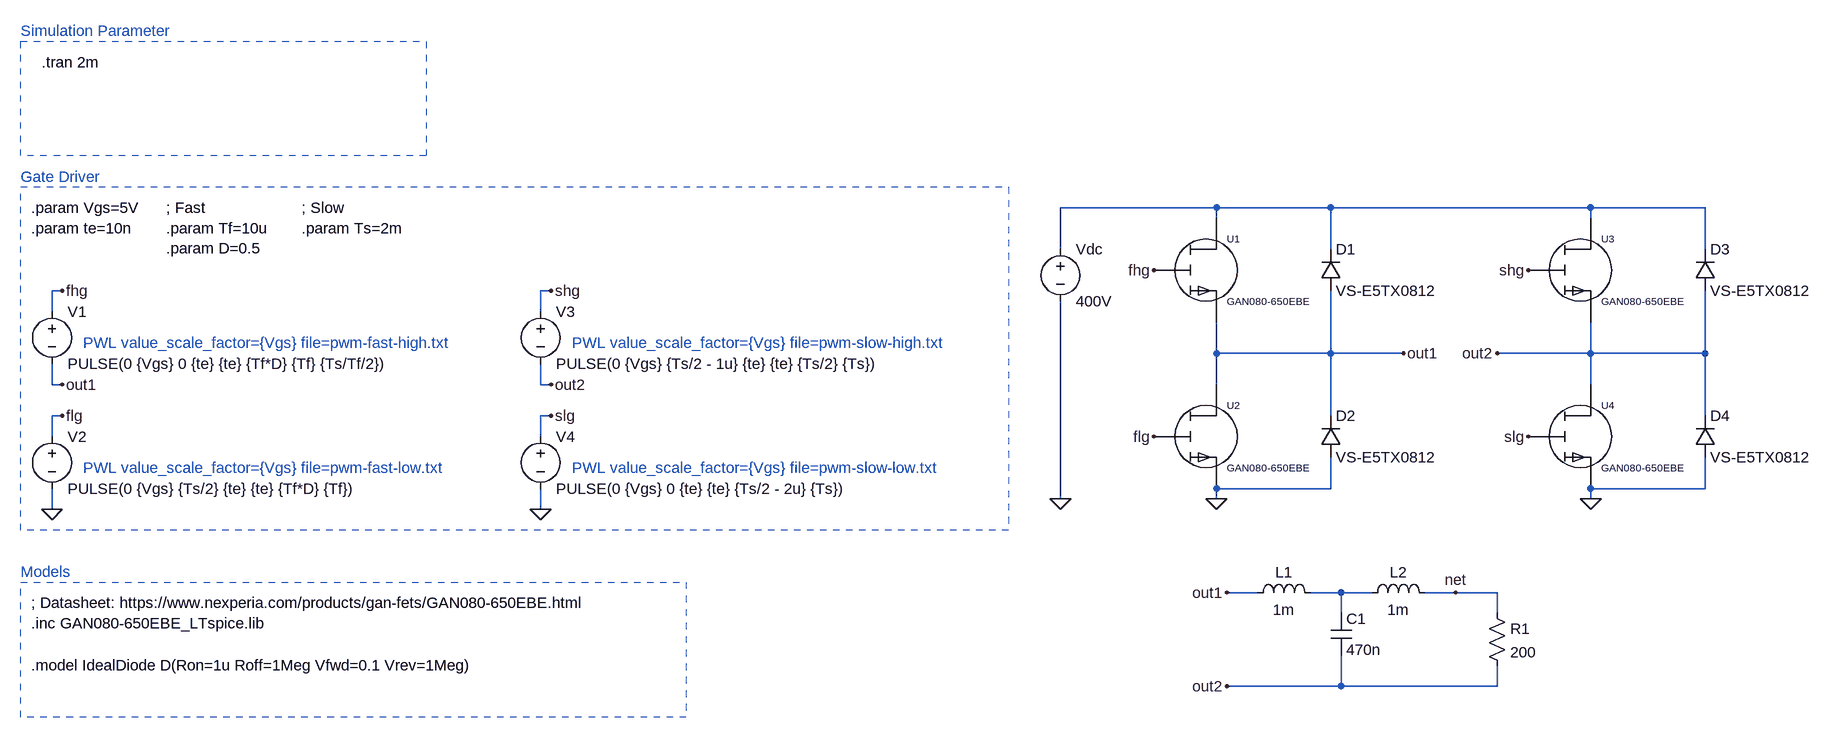
[diagram p0: schematic dc-ac-inverter.asc]
dc-ac-inverter.asc, the LTspice schematic file:
Version 4
SHEET 1 4648 30344
WIRE 560 -416 320 -416
WIRE 736 -416 560 -416
WIRE 1136 -416 736 -416
WIRE 1312 -416 1136 -416
WIRE 560 -400 560 -416
WIRE 1136 -400 1136 -416
WIRE 320 -352 320 -416
WIRE 736 -352 736 -416
WIRE 1312 -352 1312 -416
WIRE -1216 -288 -1232 -288
WIRE -464 -288 -480 -288
WIRE -1232 -256 -1232 -288
WIRE -480 -256 -480 -288
WIRE 560 -192 560 -240
WIRE 736 -192 736 -288
WIRE 736 -192 560 -192
WIRE 848 -192 736 -192
WIRE 1136 -192 1136 -240
WIRE 1136 -192 992 -192
WIRE 1312 -192 1312 -288
WIRE 1312 -192 1136 -192
WIRE -1232 -144 -1232 -176
WIRE -1216 -144 -1232 -144
WIRE -480 -144 -480 -176
WIRE -464 -144 -480 -144
WIRE 560 -144 560 -192
WIRE 1136 -144 1136 -192
WIRE -1216 -96 -1232 -96
WIRE -464 -96 -480 -96
WIRE 736 -96 736 -192
WIRE 1312 -96 1312 -192
WIRE -1232 -64 -1232 -96
WIRE -480 -64 -480 -96
WIRE 736 16 736 -32
WIRE 736 16 560 16
WIRE 1312 16 1312 -32
WIRE 1312 16 1136 16
WIRE 320 32 320 -272
WIRE 560 32 560 16
WIRE 1136 32 1136 16
WIRE -1232 48 -1232 16
WIRE -480 48 -480 16
WIRE 624 176 576 176
WIRE 752 176 704 176
WIRE 800 176 752 176
WIRE 928 176 880 176
WIRE 992 176 928 176
WIRE 752 208 752 176
WIRE 992 208 992 176
WIRE 752 320 752 272
WIRE 752 320 576 320
WIRE 992 320 992 288
WIRE 992 320 752 320
FLAG 464 -320 fhg
FLAG 464 -64 flg
FLAG 1040 -320 shg
FLAG 1040 -64 slg
FLAG 560 32 0
FLAG 1136 32 0
FLAG 320 32 0
FLAG -1216 -288 fhg
FLAG -1216 -144 out1
FLAG -1216 -96 flg
FLAG -1232 48 0
FLAG -464 -288 shg
FLAG -464 -144 out2
FLAG -464 -96 slg
FLAG -480 48 0
FLAG 848 -192 out1
FLAG 992 -192 out2
FLAG 576 176 out1
FLAG 576 320 out2
FLAG 928 176 net
SYMBOL voltage -1232 -272 R0
WINDOW 123 0 0 Left 0
WINDOW 39 0 0 Left 0
SYMATTR InstName V1
SYMATTR Value PULSE(0 {Vgs} 0 {te} {te} {Tf*D} {Tf} {Ts/Tf/2})
SYMBOL GAN080-650EBE 544 -320 R0
SYMATTR InstName U1
SYMBOL voltage 320 -368 R0
SYMATTR InstName Vdc
SYMATTR Value 400V
SYMBOL GAN080-650EBE 544 -64 R0
SYMATTR InstName U2
SYMBOL GAN080-650EBE 1120 -320 R0
SYMATTR InstName U3
SYMBOL GAN080-650EBE 1120 -64 R0
SYMATTR InstName U4
SYMBOL res 976 192 R0
SYMATTR InstName R1
SYMATTR Value 200
SYMBOL voltage -1232 -80 R0
WINDOW 123 0 0 Left 0
WINDOW 39 0 0 Left 0
SYMATTR InstName V2
SYMATTR Value PULSE(0 {Vgs} {Ts/2} {te} {te} {Tf*D} {Tf})
SYMBOL voltage -480 -272 R0
WINDOW 123 0 0 Left 0
WINDOW 39 0 0 Left 0
SYMATTR InstName V3
SYMATTR Value PULSE(0 {Vgs} {Ts/2 - 1u} {te} {te} {Ts/2} {Ts})
SYMBOL voltage -480 -80 R0
WINDOW 123 0 0 Left 0
WINDOW 39 0 0 Left 0
SYMATTR InstName V4
SYMATTR Value PULSE(0 {Vgs} 0 {te} {te} {Ts/2 - 2u} {Ts})
SYMBOL diode 720 -288 M180
WINDOW 0 24 64 Left 2
WINDOW 3 24 0 Left 2
SYMATTR InstName D1
SYMATTR Value VS-E5TX0812
SYMBOL diode 720 -32 M180
WINDOW 0 24 64 Left 2
WINDOW 3 24 0 Left 2
SYMATTR InstName D2
SYMATTR Value VS-E5TX0812
SYMBOL diode 1296 -288 M180
WINDOW 0 24 64 Left 2
WINDOW 3 24 0 Left 2
SYMATTR InstName D3
SYMATTR Value VS-E5TX0812
SYMBOL diode 1296 -32 M180
WINDOW 0 24 64 Left 2
WINDOW 3 24 0 Left 2
SYMATTR InstName D4
SYMATTR Value VS-E5TX0812
SYMBOL ind 608 192 R270
WINDOW 0 32 56 VTop 2
WINDOW 3 5 56 VBottom 2
SYMATTR InstName L1
SYMATTR Value 1m
SYMBOL cap 736 208 R0
SYMATTR InstName C1
SYMATTR Value 470n
SYMBOL ind 784 192 R270
WINDOW 0 32 56 VTop 2
WINDOW 3 5 56 VBottom 2
SYMATTR InstName L2
SYMATTR Value 1m
TEXT -1264 288 Left 2 !.model IdealDiode D(Ron=1u Roff=1Meg Vfwd=0.1 Vrev=1Meg)
TEXT -1280 -464 Left 2 ;Gate Driver
TEXT -1264 -416 Left 2 !.param Vgs=5V\n.param te=10n
TEXT -1280 144 Left 2 ;Models
TEXT -1248 -640 Left 2 !.tran 2m
TEXT -1280 -688 Left 2 ;Simulation Parameter
TEXT -1264 192 Left 2 !; Datasheet: https://www.nexperia.com/products/gan-fets/GAN080-650EBE.html\n.inc GAN080-650EBE_LTspice.lib
TEXT -1056 -416 Left 2 !; Fast\n.param Tf=10u\n.param D=0.5
TEXT -848 -416 Left 2 !; Slow\n.param Ts=2m
TEXT -1184 -208 Left 2 ;PWL value_scale_factor={Vgs} file=pwm-fast-high.txt
TEXT -432 -208 Left 2 ;PWL value_scale_factor={Vgs} file=pwm-slow-high.txt
TEXT -432 -16 Left 2 ;PWL value_scale_factor={Vgs} file=pwm-slow-low.txt
TEXT -1184 -16 Left 2 ;PWL value_scale_factor={Vgs} file=pwm-fast-low.txt
RECTANGLE Normal 240 80 -1280 -448 2
RECTANGLE Normal -656 -496 -1280 -672 2
RECTANGLE Normal -256 368 -1280 160 2

The netlist it stands for:
* dc-ac-inverter.asc
V1 fhg out1 PULSE(0 {Vgs} 0 {te} {te} {Tf*D} {Tf} {Ts/Tf/2})
XU1 fhg N001 out1 GAN080-650EBE  ; pins Gate Drain Source
Vdc N001 0 400V
XU2 flg out1 0 GAN080-650EBE  ; pins Gate Drain Source
XU3 shg N001 out2 GAN080-650EBE  ; pins Gate Drain Source
XU4 slg out2 0 GAN080-650EBE  ; pins Gate Drain Source
R1 net out2 200
V2 flg 0 PULSE(0 {Vgs} {Ts/2} {te} {te} {Tf*D} {Tf})
V3 shg out2 PULSE(0 {Vgs} {Ts/2 - 1u} {te} {te} {Ts/2} {Ts})
V4 slg 0 PULSE(0 {Vgs} 0 {te} {te} {Ts/2 - 2u} {Ts})
D1 out1 N001 VS-E5TX0812
D2 0 out1 VS-E5TX0812
D3 out2 N001 VS-E5TX0812
D4 0 out2 VS-E5TX0812
L1 out1 N002 1m
C1 N002 out2 470n
L2 N002 net 1m
.model D D
.lib standard.dio
.model IdealDiode D(Ron=1u Roff=1Meg Vfwd=0.1 Vrev=1Meg)
* Gate Driver
.param Vgs=5V
.param te=10n
* Models
.tran 2m
* Simulation Parameter
; Datasheet: https://www.nexperia.com/products/gan-fets/GAN080-650EBE.html
.inc GAN080-650EBE_LTspice.lib
; Fast
.param Tf=10u
.param D=0.5
; Slow
.param Ts=2m
* PWL value_scale_factor={Vgs} file=pwm-fast-high.txt
* PWL value_scale_factor={Vgs} file=pwm-slow-high.txt
* PWL value_scale_factor={Vgs} file=pwm-slow-low.txt
* PWL value_scale_factor={Vgs} file=pwm-fast-low.txt
.lib GAN080-650EBE_LTspice.lib
.backanno
.end